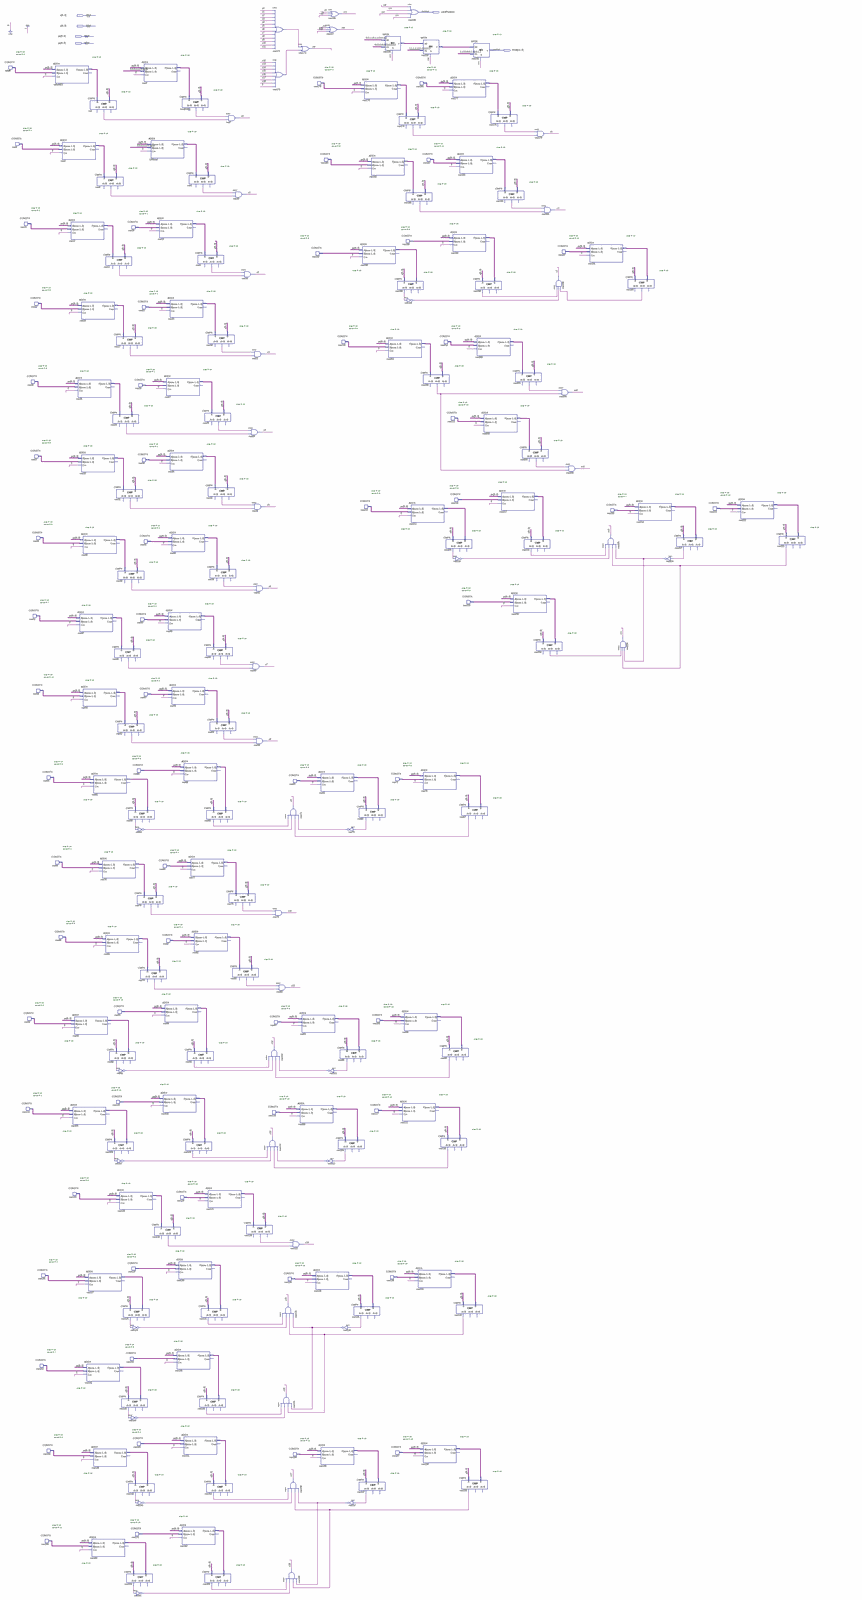
[diagram p0: schematic sheet, whole]
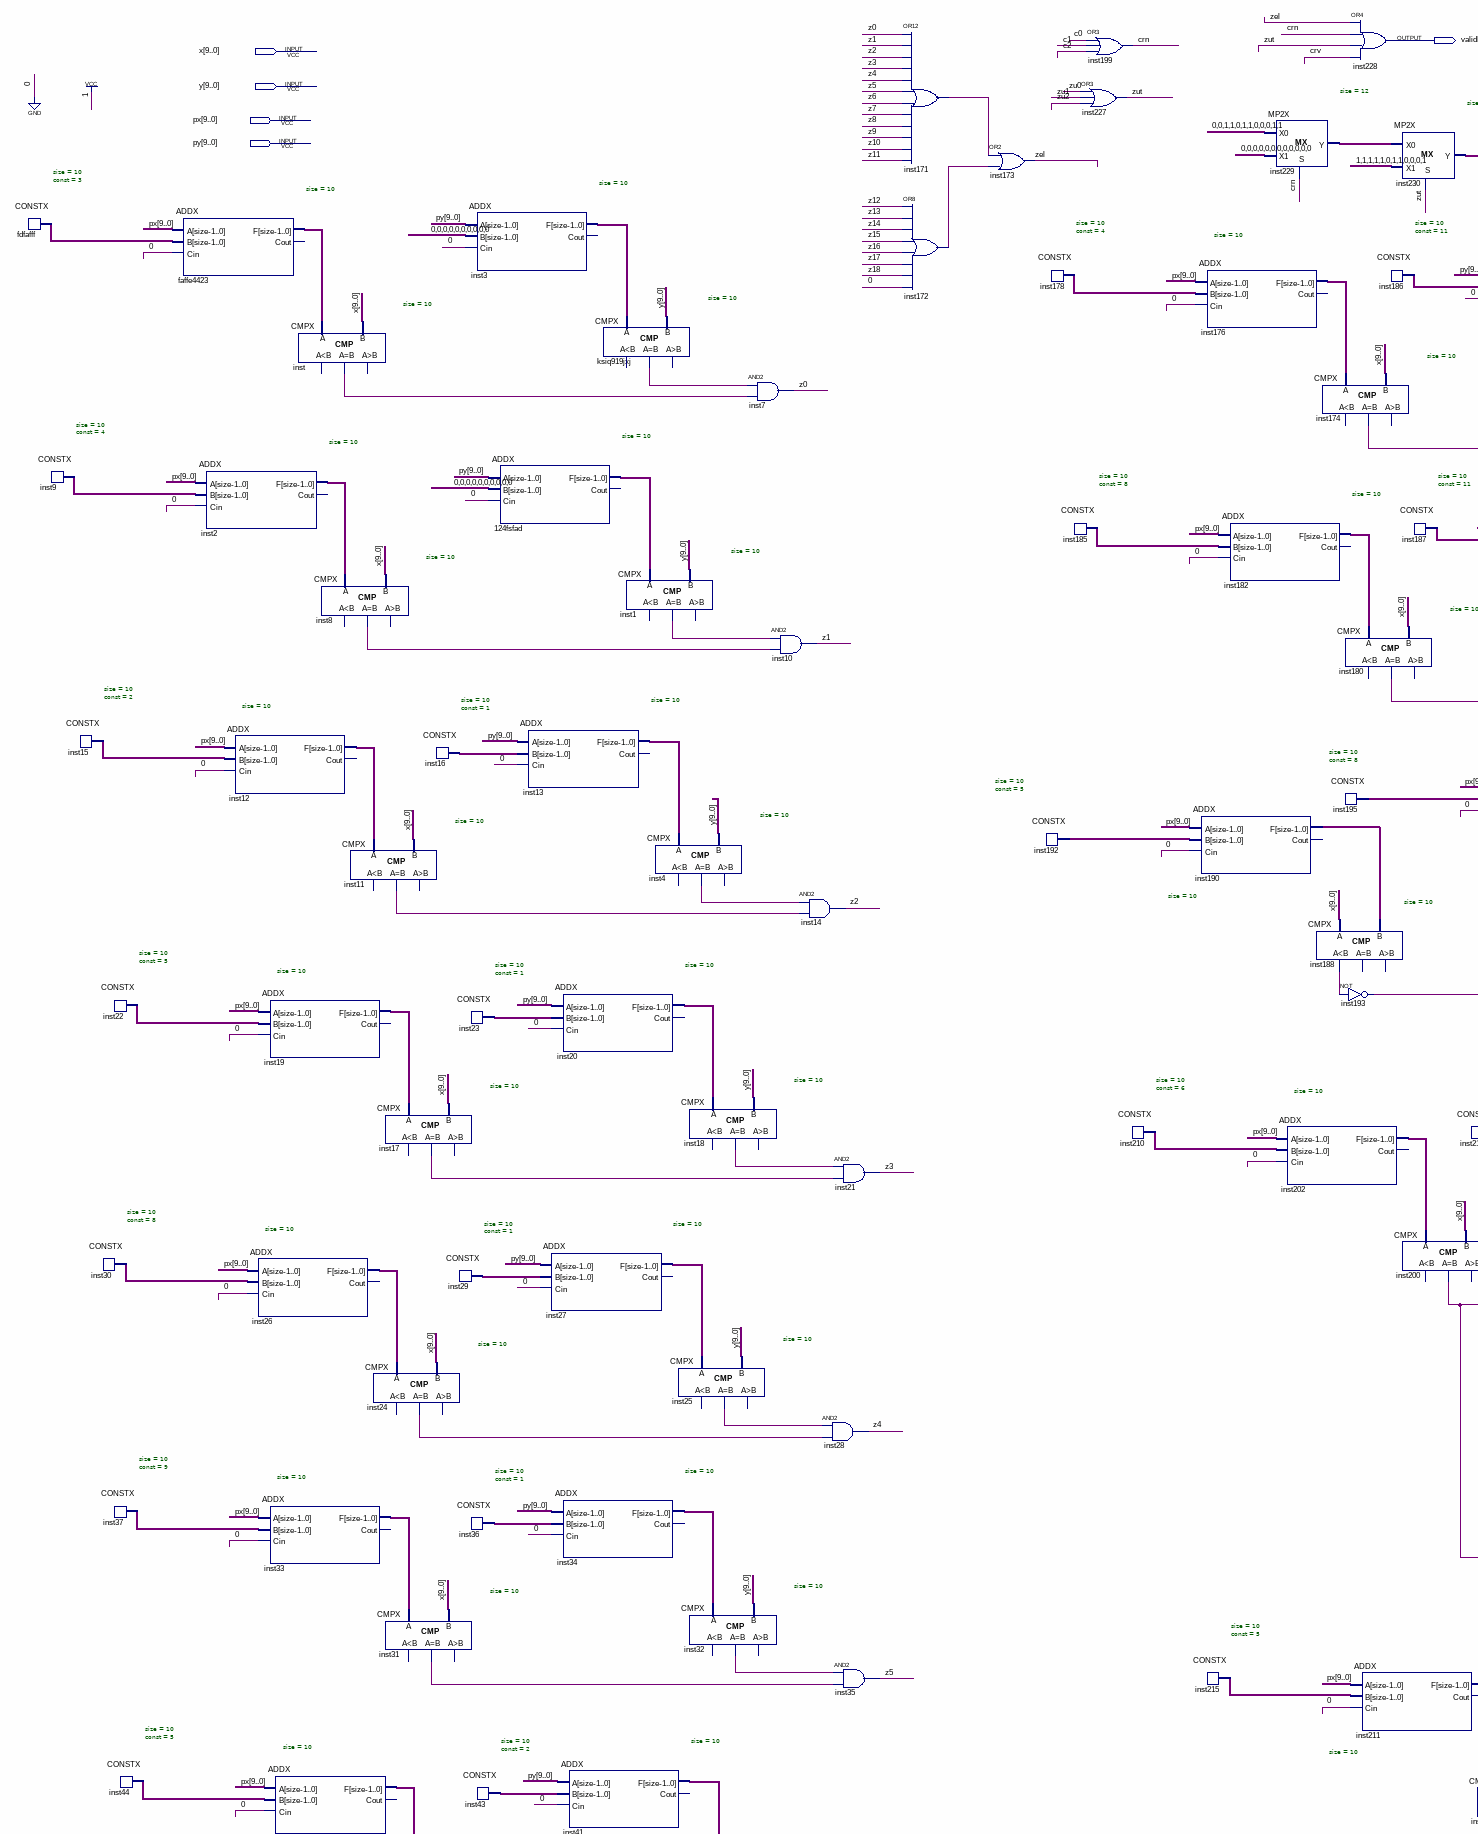
[diagram p1: schematic sheet, upper left part]
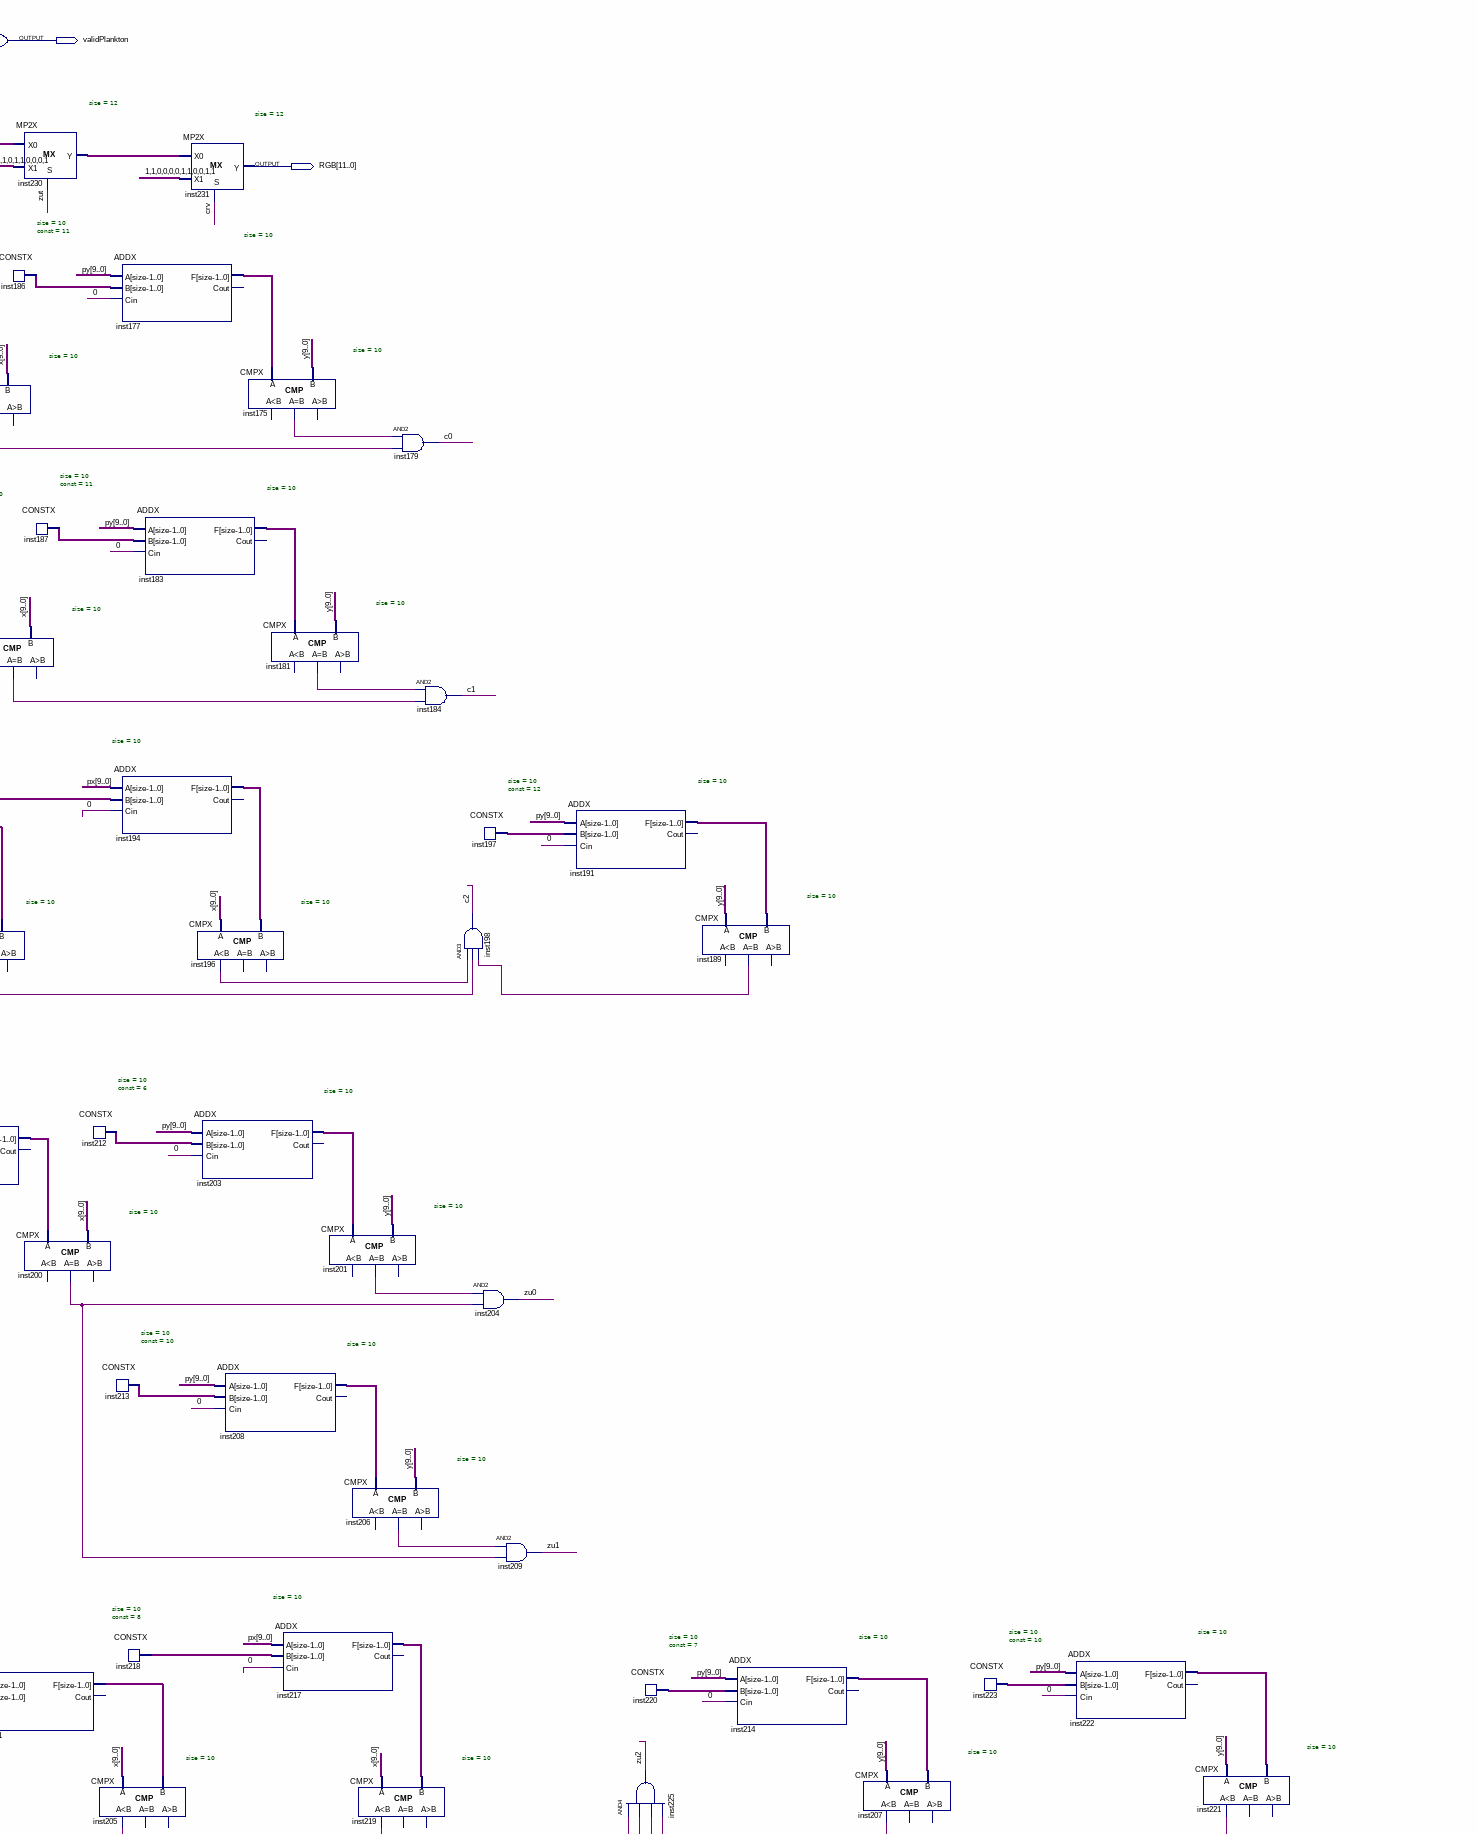
[diagram p2: schematic sheet, upper right part]
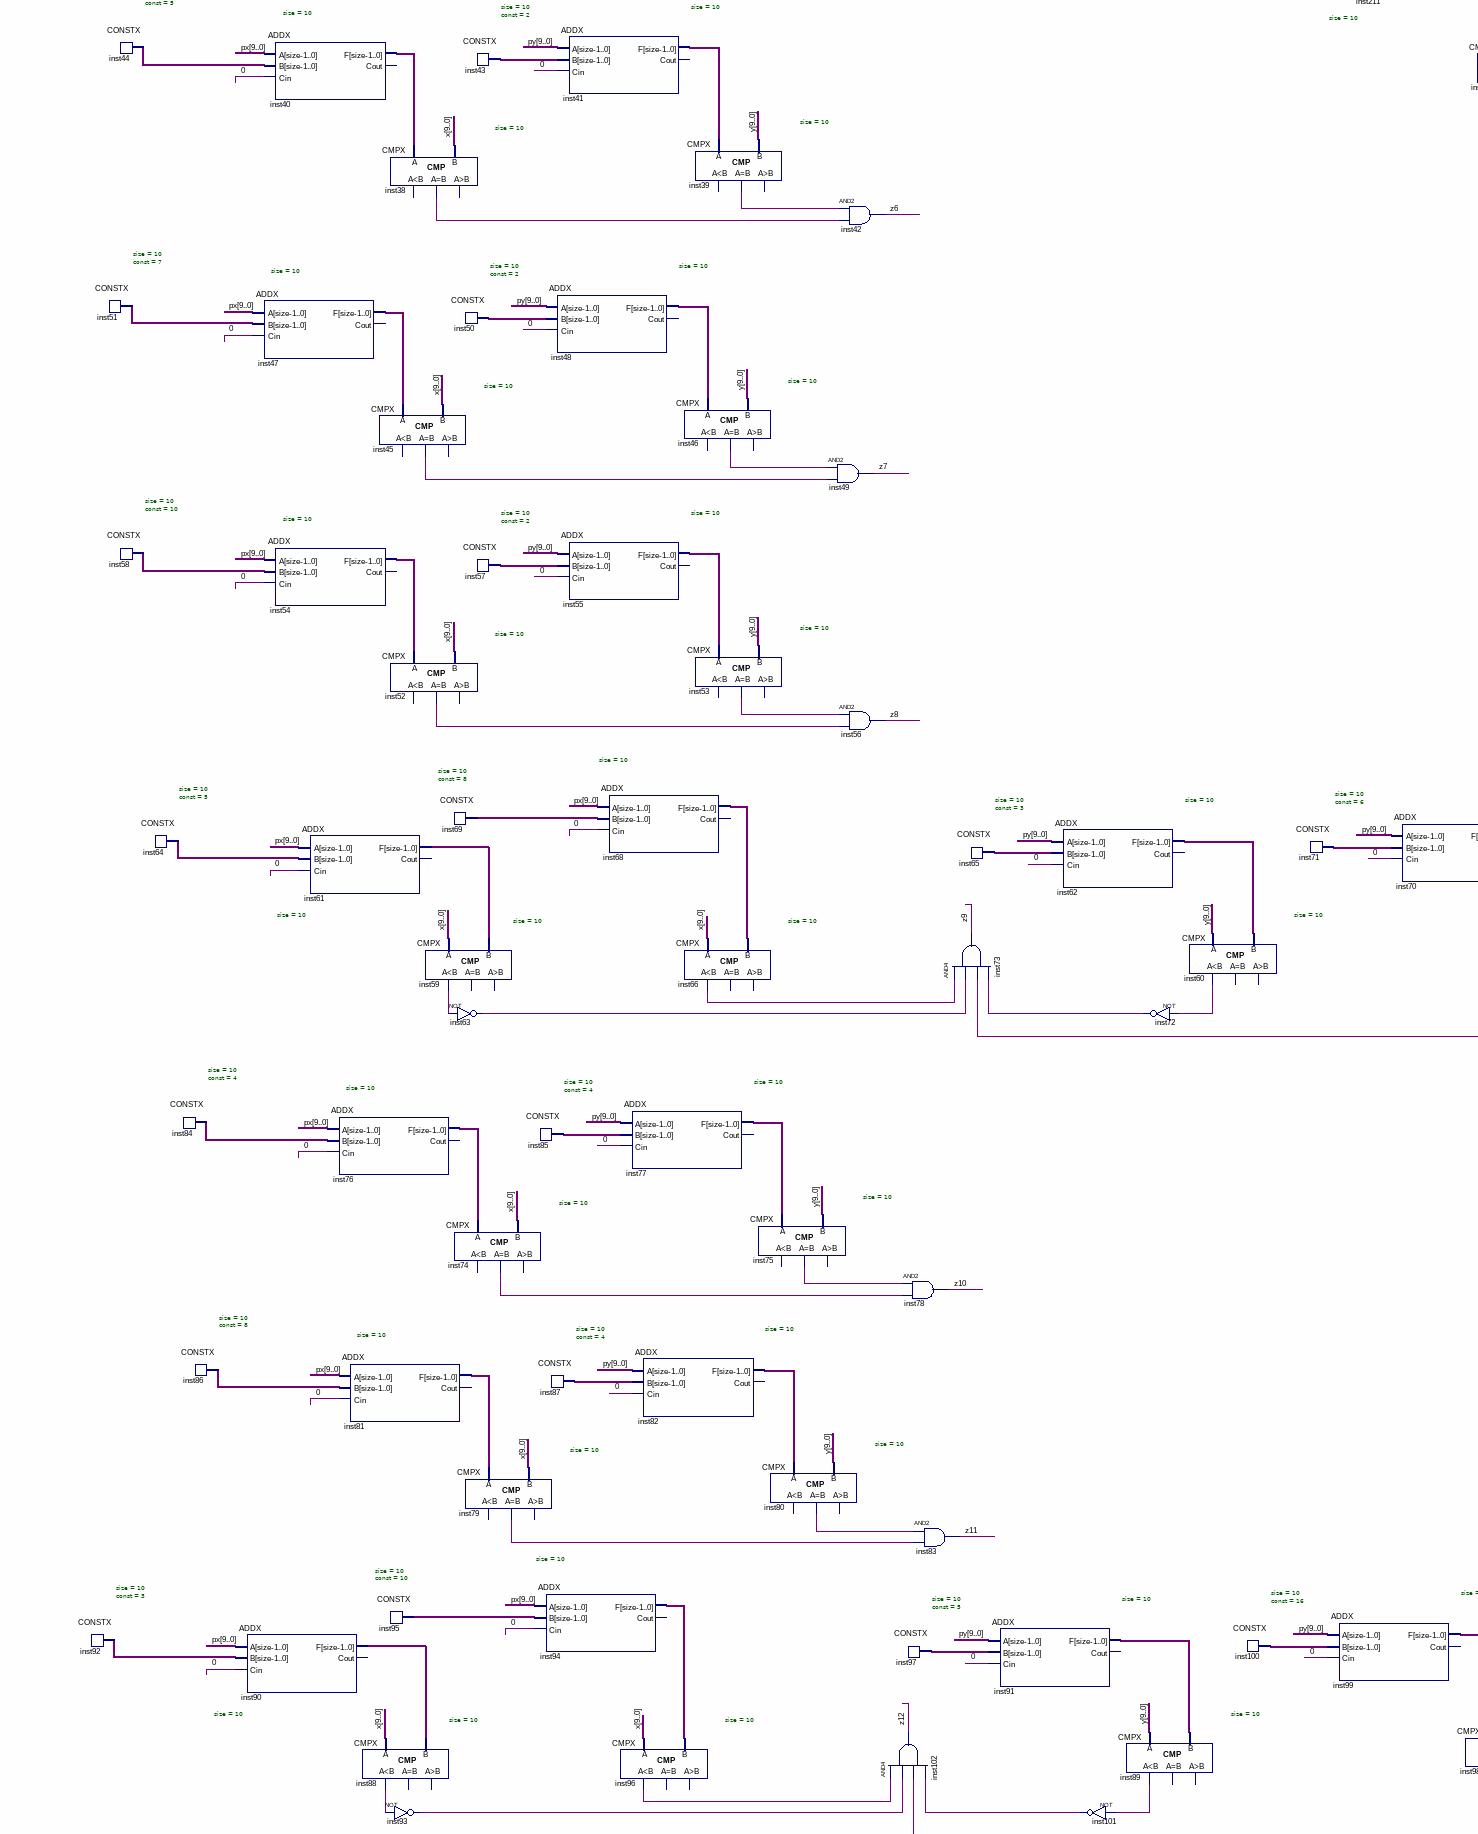
[diagram p3: schematic sheet, middle left part]
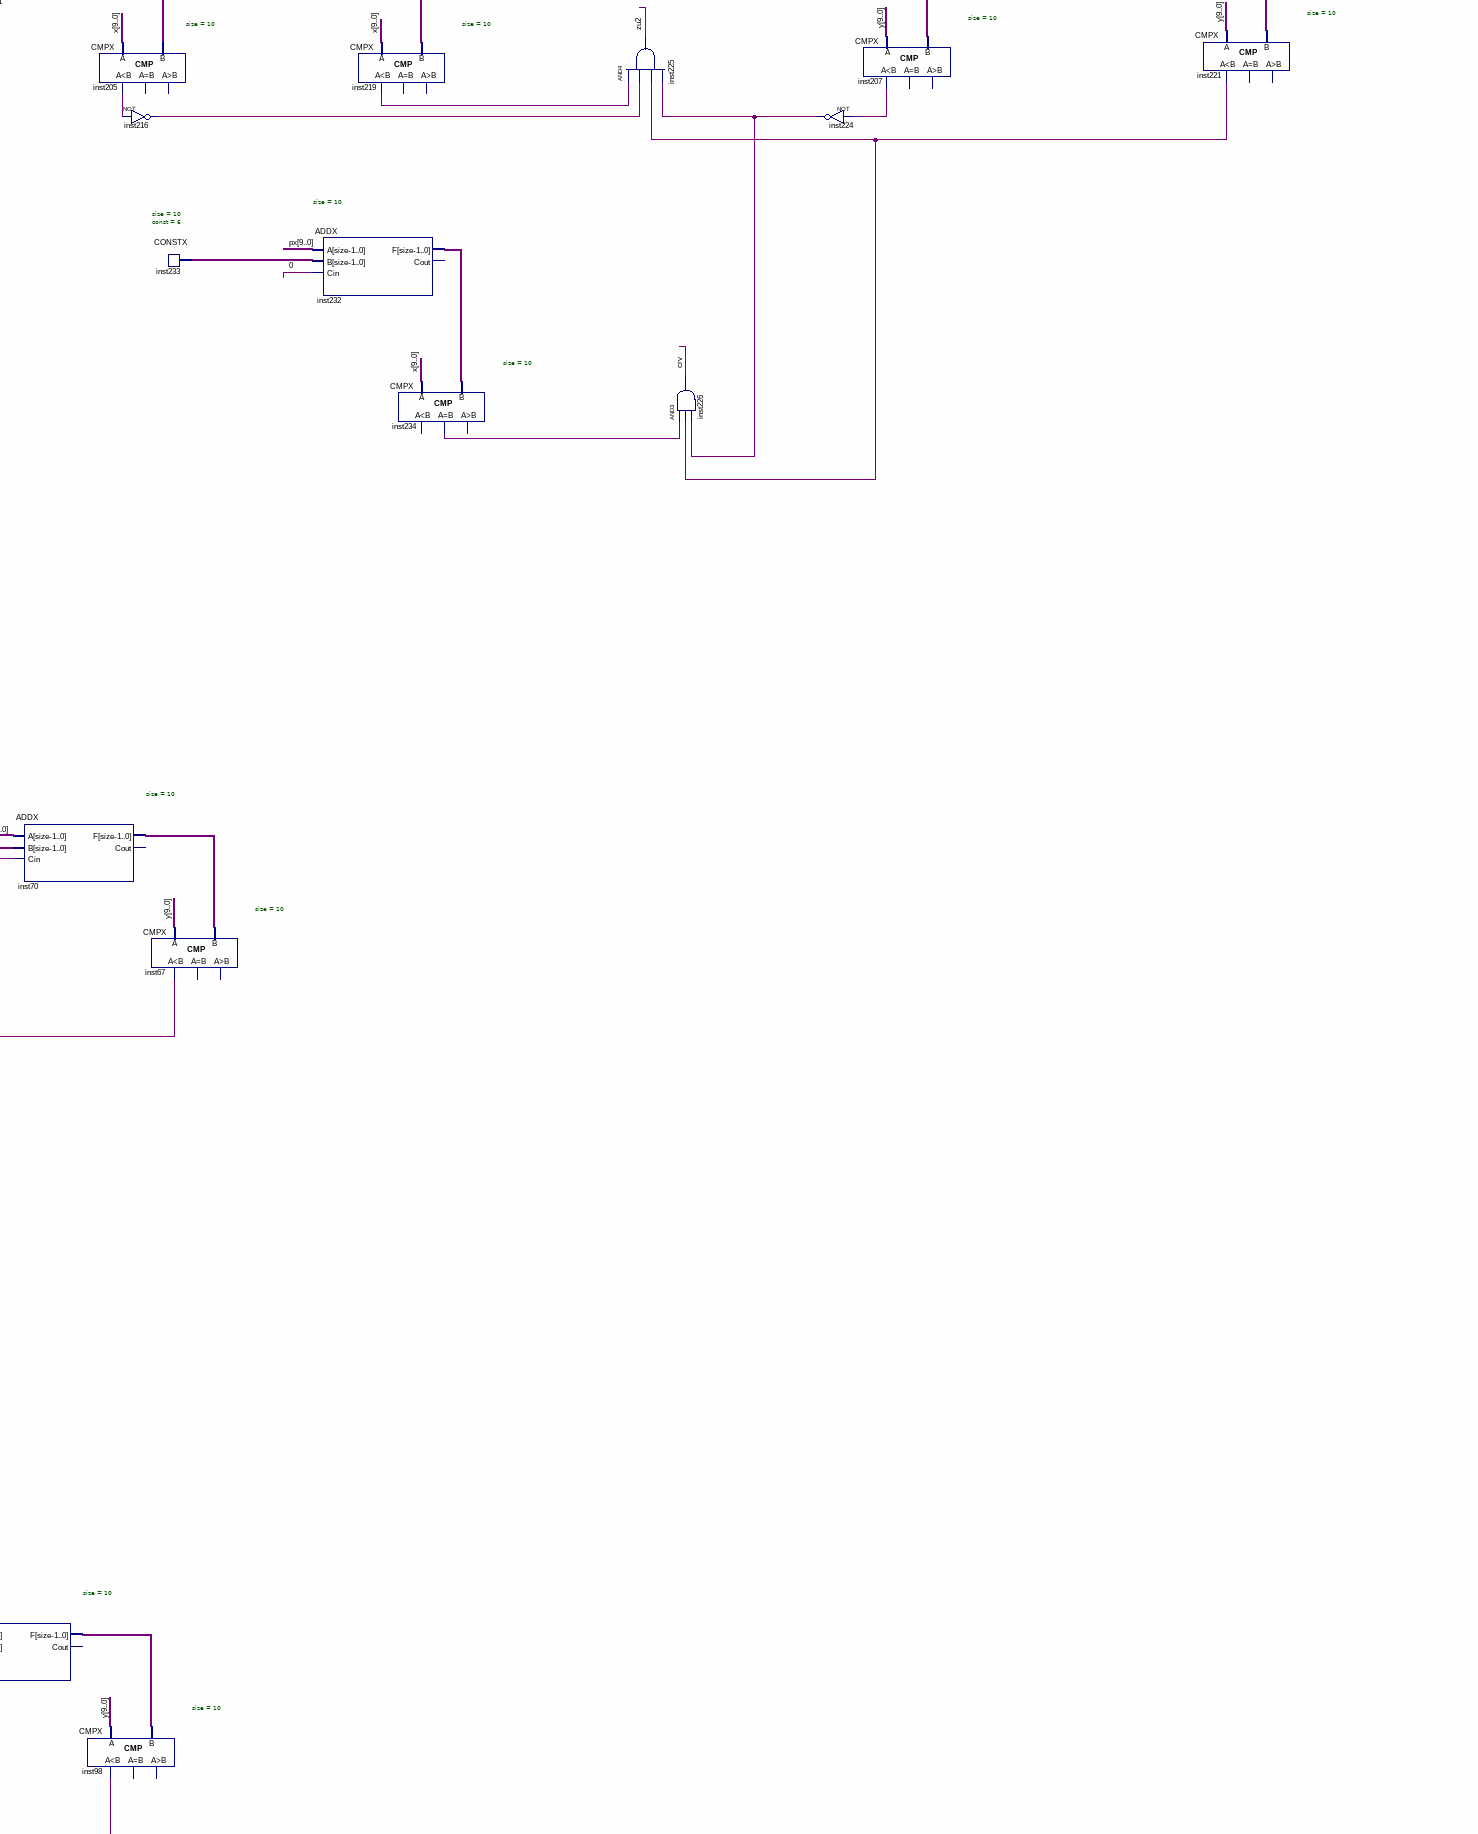
[diagram p4: schematic sheet, middle right part]
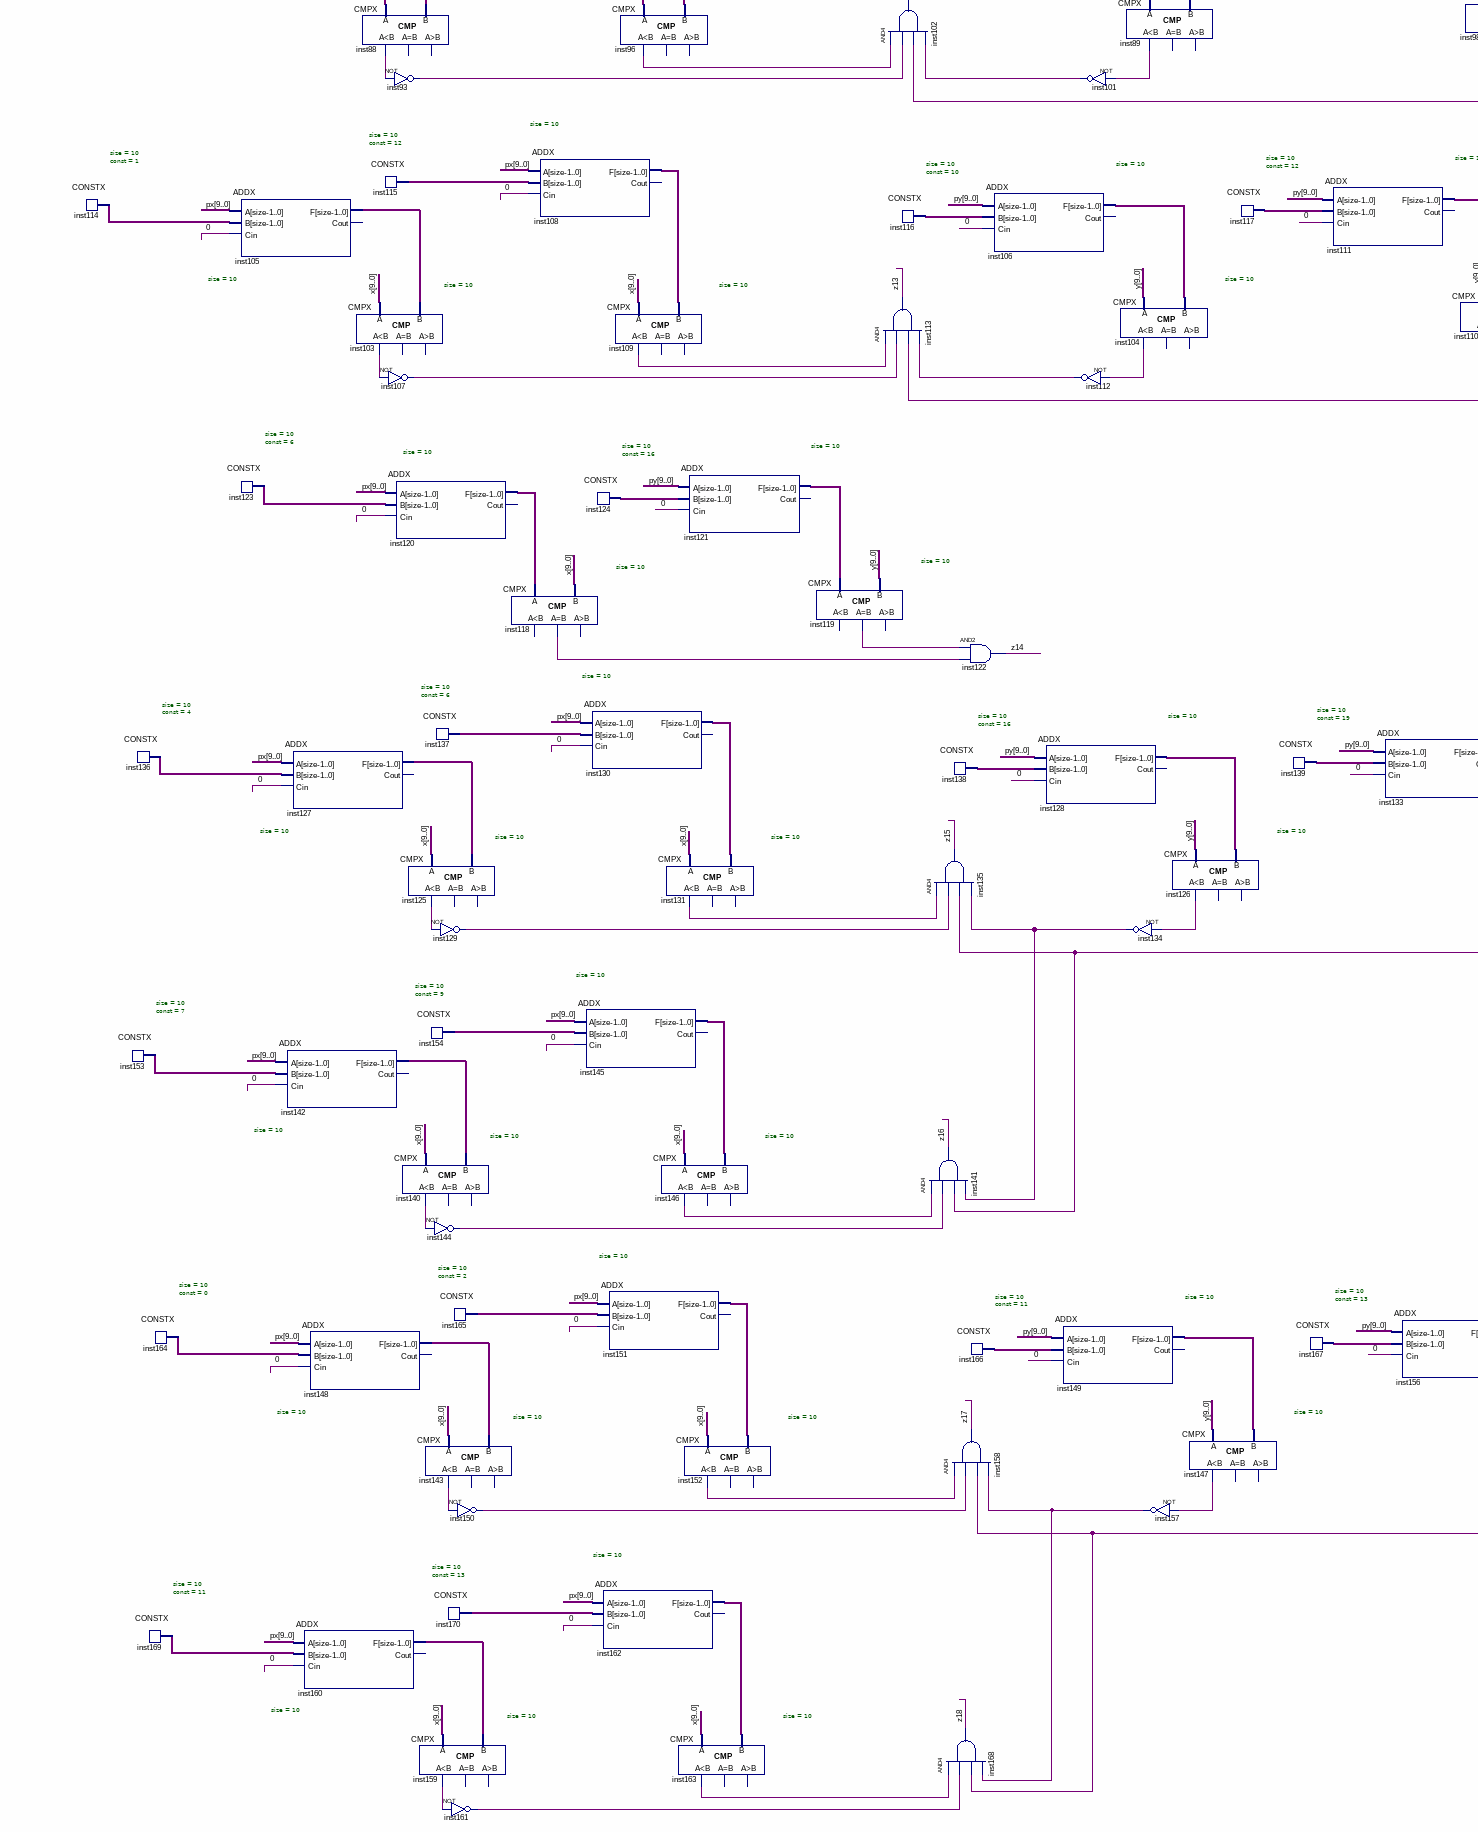
[diagram p5: schematic sheet, lower left part]
// Quartus schematic plankton.bdf as structural Verilog: 237 symbols, 6 pins
module plankton (
  input  [9:0] x,
  input  [9:0] y,
  input  [9:0] px,
  input  [9:0] py,
  output validPlankton,
  output [11:0] RGB
);

  wire c0, c1, c2, crn, crv, inst1_eq, inst4_eq, inst8_eq, inst11_eq, inst17_eq, inst18_eq, inst24_eq,
       inst25_eq, inst31_eq, inst32_eq, inst38_eq, inst39_eq, inst45_eq, inst46_eq, inst52_eq, inst53_eq,
       inst59_ls, inst60_ls, inst63_out, inst66_ls, inst67_ls, inst72_out, inst74_eq, inst75_eq, inst79_eq,
       inst80_eq, inst88_ls, inst89_ls, inst93_out, inst96_ls, inst98_ls, inst101_out, inst103_ls,
       inst104_ls, inst107_out, inst109_ls, inst110_ls, inst112_out, inst118_eq, inst119_eq, inst125_ls,
       inst126_ls, inst129_out, inst131_ls, inst132_ls, inst134_out, inst140_ls, inst143_ls, inst144_out,
       inst146_ls, inst147_ls, inst150_out, inst152_ls, inst155_ls, inst157_out, inst159_ls, inst161_out,
       inst163_ls, inst171_out, inst172_out, inst174_eq, inst175_eq, inst180_eq, inst181_eq, inst188_ls,
       inst189_eq, inst193_out, inst196_ls, inst200_eq, inst201_eq, inst205_ls, inst206_eq, inst207_ls,
       inst216_out, inst219_ls, inst221_ls, inst224_out, inst234_eq, inst_eq, ksiq919jxj_eq, z0, z1, z2, z3,
       z4, z5, z6, z7, z8, z9, z10, z11, z12, z13, z14, z15, z16, z17, z18, zel, zu0, zu1, zu2, zut;
  wire [9:0] faffe4423_f, fdfafff_data, inst2_f, inst3_f, inst9_data, inst12_f, inst13_f, inst15_data,
       inst16_data, inst19_f, inst20_f, inst22_data, inst23_data, inst26_f, inst27_f, inst29_data,
       inst30_data, inst33_f, inst34_f, inst36_data, inst37_data, inst40_f, inst41_f, inst43_data,
       inst44_data, inst47_f, inst48_f, inst50_data, inst51_data, inst54_f, inst55_f, inst57_data,
       inst58_data, inst61_f, inst62_f, inst64_data, inst65_data, inst68_f, inst69_data, inst70_f,
       inst71_data, inst76_f, inst77_f, inst81_f, inst82_f, inst84_data, inst85_data, inst86_data,
       inst87_data, inst90_f, inst91_f, inst92_data, inst94_f, inst95_data, inst97_data, inst99_f,
       inst100_data, inst105_f, inst106_f, inst108_f, inst111_f, inst114_data, inst115_data, inst116_data,
       inst117_data, inst120_f, inst121_f, inst123_data, inst124_data, inst127_f, inst128_f, inst130_f,
       inst133_f, inst136_data, inst137_data, inst138_data, inst139_data, inst142_f, inst145_f, inst148_f,
       inst149_f, inst151_f, inst153_data, inst154_data, inst156_f, inst160_f, inst162_f, inst164_data,
       inst165_data, inst166_data, inst167_data, inst169_data, inst170_data, inst176_f, inst177_f,
       inst178_data, inst182_f, inst183_f, inst185_data, inst186_data, inst187_data, inst190_f, inst191_f,
       inst192_data, inst194_f, inst195_data, inst197_data, inst202_f, inst203_f, inst208_f, inst210_data,
       inst211_f, inst212_data, inst213_data, inst214_f, inst215_data, inst217_f, inst218_data, inst220_data,
       inst222_f, inst223_data, inst232_f, inst233_data, n124fsfad_f;
  wire [11:0] inst229_y, inst230_y;

  CONSTX #(.size(10), .\const (3)) fdfafff (.data(fdfafff_data));
  CONSTX #(.size(10), .\const (4)) inst9 (.data(inst9_data));
  CONSTX #(.size(10), .\const (2)) inst15 (.data(inst15_data));
  CONSTX #(.size(10), .\const (5)) inst22 (.data(inst22_data));
  CONSTX #(.size(10), .\const (8)) inst30 (.data(inst30_data));
  CONSTX #(.size(10), .\const (9)) inst37 (.data(inst37_data));
  CONSTX #(.size(10), .\const (5)) inst44 (.data(inst44_data));
  CONSTX #(.size(10), .\const (7)) inst51 (.data(inst51_data));
  CONSTX #(.size(10), .\const (10)) inst58 (.data(inst58_data));
  CONSTX #(.size(10), .\const (3)) inst92 (.data(inst92_data));
  CONSTX #(.size(10), .\const (1)) inst114 (.data(inst114_data));
  CONSTX #(.size(10), .\const (5)) inst64 (.data(inst64_data));
  CONSTX #(.size(10), .\const (4)) inst136 (.data(inst136_data));
  CONSTX #(.size(10), .\const (7)) inst153 (.data(inst153_data));
  CONSTX #(.size(10), .\const (0)) inst164 (.data(inst164_data));
  CONSTX #(.size(10), .\const (11)) inst169 (.data(inst169_data));
  ADDX #(.size(10)) faffe4423 (.A(px), .B(fdfafff_data), .Cin(1'b0), .F(faffe4423_f));  // open: Cout
  ADDX #(.size(10)) inst2 (.A(px), .B(inst9_data), .Cin(1'b0), .F(inst2_f));  // open: Cout
  CONSTX #(.size(10), .\const (4)) inst84 (.data(inst84_data));
  CONSTX #(.size(10), .\const (8)) inst86 (.data(inst86_data));
  ADDX #(.size(10)) inst12 (.A(px), .B(inst15_data), .Cin(1'b0), .F(inst12_f));  // open: Cout
  ADDX #(.size(10)) inst26 (.A(px), .B(inst30_data), .Cin(1'b0), .F(inst26_f));  // open: Cout
  ADDX #(.size(10)) inst90 (.A(px), .B(inst92_data), .Cin(1'b0), .F(inst90_f));  // open: Cout
  ADDX #(.size(10)) inst105 (.A(px), .B(inst114_data), .Cin(1'b0), .F(inst105_f));  // open: Cout
  CONSTX #(.size(10), .\const (6)) inst123 (.data(inst123_data));
  CMPX #(.size(10)) inst (.A(faffe4423_f), .B(x), .eq(inst_eq));  // open: ls, gr
  ADDX #(.size(10)) inst19 (.A(px), .B(inst22_data), .Cin(1'b0), .F(inst19_f));  // open: Cout
  ADDX #(.size(10)) inst33 (.A(px), .B(inst37_data), .Cin(1'b0), .F(inst33_f));  // open: Cout
  ADDX #(.size(10)) inst40 (.A(px), .B(inst44_data), .Cin(1'b0), .F(inst40_f));  // open: Cout
  ADDX #(.size(10)) inst47 (.A(px), .B(inst51_data), .Cin(1'b0), .F(inst47_f));  // open: Cout
  ADDX #(.size(10)) inst54 (.A(px), .B(inst58_data), .Cin(1'b0), .F(inst54_f));  // open: Cout
  ADDX #(.size(10)) inst127 (.A(px), .B(inst136_data), .Cin(1'b0), .F(inst127_f));  // open: Cout
  ADDX #(.size(10)) inst142 (.A(px), .B(inst153_data), .Cin(1'b0), .F(inst142_f));  // open: Cout
  ADDX #(.size(10)) inst160 (.A(px), .B(inst169_data), .Cin(1'b0), .F(inst160_f));  // open: Cout
  CMPX #(.size(10)) inst8 (.A(inst2_f), .B(x), .eq(inst8_eq));  // open: ls, gr
  CMPX #(.size(10)) inst11 (.A(inst12_f), .B(x), .eq(inst11_eq));  // open: ls, gr
  ADDX #(.size(10)) inst61 (.A(px), .B(inst64_data), .Cin(1'b0), .F(inst61_f));  // open: Cout
  ADDX #(.size(10)) inst76 (.A(px), .B(inst84_data), .Cin(1'b0), .F(inst76_f));  // open: Cout
  ADDX #(.size(10)) inst81 (.A(px), .B(inst86_data), .Cin(1'b0), .F(inst81_f));  // open: Cout
  ADDX #(.size(10)) inst148 (.A(px), .B(inst164_data), .Cin(1'b0), .F(inst148_f));  // open: Cout
  CMPX #(.size(10)) inst17 (.A(inst19_f), .B(x), .eq(inst17_eq));  // open: ls, gr
  CMPX #(.size(10)) inst24 (.A(inst26_f), .B(x), .eq(inst24_eq));  // open: ls, gr
  CMPX #(.size(10)) inst31 (.A(inst33_f), .B(x), .eq(inst31_eq));  // open: ls, gr
  CMPX #(.size(10)) inst38 (.A(inst40_f), .B(x), .eq(inst38_eq));  // open: ls, gr
  CMPX #(.size(10)) inst45 (.A(inst47_f), .B(x), .eq(inst45_eq));  // open: ls, gr
  CMPX #(.size(10)) inst52 (.A(inst54_f), .B(x), .eq(inst52_eq));  // open: ls, gr
  CONSTX #(.size(10), .\const (10)) inst95 (.data(inst95_data));
  CMPX #(.size(10)) inst88 (.A(x), .B(inst90_f), .ls(inst88_ls));  // open: eq, gr
  not inst93 (inst93_out, inst88_ls);
  CONSTX #(.size(10), .\const (12)) inst115 (.data(inst115_data));
  CMPX #(.size(10)) inst103 (.A(x), .B(inst105_f), .ls(inst103_ls));  // open: eq, gr
  not inst107 (inst107_out, inst103_ls);
  ADDX #(.size(10)) inst120 (.A(px), .B(inst123_data), .Cin(1'b0), .F(inst120_f));  // open: Cout
  CONSTX #(.size(10), .\const (1)) inst16 (.data(inst16_data));
  CMPX #(.size(10)) inst59 (.A(x), .B(inst61_f), .ls(inst59_ls));  // open: eq, gr
  CONSTX #(.size(10), .\const (6)) inst137 (.data(inst137_data));
  CMPX #(.size(10)) inst125 (.A(x), .B(inst127_f), .ls(inst125_ls));  // open: eq, gr
  not inst129 (inst129_out, inst125_ls);
  CONSTX #(.size(10), .\const (9)) inst154 (.data(inst154_data));
  CMPX #(.size(10)) inst140 (.A(x), .B(inst142_f), .ls(inst140_ls));  // open: eq, gr
  not inst144 (inst144_out, inst140_ls);
  CMPX #(.size(10)) inst143 (.A(x), .B(inst148_f), .ls(inst143_ls));  // open: eq, gr
  CONSTX #(.size(10), .\const (13)) inst170 (.data(inst170_data));
  CMPX #(.size(10)) inst159 (.A(x), .B(inst160_f), .ls(inst159_ls));  // open: eq, gr
  ADDX #(.size(10)) inst3 (.A(py), .B({10{1'b0}}), .Cin(1'b0), .F(inst3_f));  // open: Cout
  CONSTX #(.size(10), .\const (1)) inst23 (.data(inst23_data));
  CONSTX #(.size(10), .\const (1)) inst29 (.data(inst29_data));
  CONSTX #(.size(10), .\const (1)) inst36 (.data(inst36_data));
  CONSTX #(.size(10), .\const (2)) inst43 (.data(inst43_data));
  CONSTX #(.size(10), .\const (2)) inst50 (.data(inst50_data));
  CONSTX #(.size(10), .\const (2)) inst57 (.data(inst57_data));
  CONSTX #(.size(10), .\const (8)) inst69 (.data(inst69_data));
  not inst63 (inst63_out, inst59_ls);
  CMPX #(.size(10)) inst74 (.A(inst76_f), .B(x), .eq(inst74_eq));  // open: ls, gr
  CMPX #(.size(10)) inst79 (.A(inst81_f), .B(x), .eq(inst79_eq));  // open: ls, gr
  CONSTX #(.size(10), .\const (2)) inst165 (.data(inst165_data));
  not inst150 (inst150_out, inst143_ls);
  not inst161 (inst161_out, inst159_ls);
  ADDX #(.size(10)) u_124fsfad (.A(py), .B({10{1'b0}}), .Cin(1'b0), .F(n124fsfad_f));  // open: Cout
  ADDX #(.size(10)) inst13 (.A(py), .B(inst16_data), .Cin(1'b0), .F(inst13_f));  // open: Cout
  CONSTX #(.size(10), .\const (4)) inst85 (.data(inst85_data));
  CMPX #(.size(10)) inst118 (.A(inst120_f), .B(x), .eq(inst118_eq));  // open: ls, gr
  ADDX #(.size(10)) inst20 (.A(py), .B(inst23_data), .Cin(1'b0), .F(inst20_f));  // open: Cout
  ADDX #(.size(10)) inst27 (.A(py), .B(inst29_data), .Cin(1'b0), .F(inst27_f));  // open: Cout
  ADDX #(.size(10)) inst34 (.A(py), .B(inst36_data), .Cin(1'b0), .F(inst34_f));  // open: Cout
  ADDX #(.size(10)) inst41 (.A(py), .B(inst43_data), .Cin(1'b0), .F(inst41_f));  // open: Cout
  ADDX #(.size(10)) inst48 (.A(py), .B(inst50_data), .Cin(1'b0), .F(inst48_f));  // open: Cout
  ADDX #(.size(10)) inst55 (.A(py), .B(inst57_data), .Cin(1'b0), .F(inst55_f));  // open: Cout
  CONSTX #(.size(10), .\const (4)) inst87 (.data(inst87_data));
  ADDX #(.size(10)) inst94 (.A(px), .B(inst95_data), .Cin(1'b0), .F(inst94_f));  // open: Cout
  ADDX #(.size(10)) inst108 (.A(px), .B(inst115_data), .Cin(1'b0), .F(inst108_f));  // open: Cout
  CMPX #(.size(10)) ksiq919jxj (.A(inst3_f), .B(y), .eq(ksiq919jxj_eq));  // open: ls, gr
  CMPX #(.size(10)) inst1 (.A(n124fsfad_f), .B(y), .eq(inst1_eq));  // open: ls, gr
  ADDX #(.size(10)) inst68 (.A(px), .B(inst69_data), .Cin(1'b0), .F(inst68_f));  // open: Cout
  CMPX #(.size(10)) inst96 (.A(x), .B(inst94_f), .ls(inst96_ls));  // open: eq, gr
  CMPX #(.size(10)) inst109 (.A(x), .B(inst108_f), .ls(inst109_ls));  // open: eq, gr
  CONSTX #(.size(10), .\const (16)) inst124 (.data(inst124_data));
  ADDX #(.size(10)) inst130 (.A(px), .B(inst137_data), .Cin(1'b0), .F(inst130_f));  // open: Cout
  ADDX #(.size(10)) inst145 (.A(px), .B(inst154_data), .Cin(1'b0), .F(inst145_f));  // open: Cout
  ADDX #(.size(10)) inst151 (.A(px), .B(inst165_data), .Cin(1'b0), .F(inst151_f));  // open: Cout
  ADDX #(.size(10)) inst162 (.A(px), .B(inst170_data), .Cin(1'b0), .F(inst162_f));  // open: Cout
  CMPX #(.size(10)) inst4 (.A(inst13_f), .B(y), .eq(inst4_eq));  // open: ls, gr
  ADDX #(.size(10)) inst77 (.A(py), .B(inst85_data), .Cin(1'b0), .F(inst77_f));  // open: Cout
  ADDX #(.size(10)) inst82 (.A(py), .B(inst87_data), .Cin(1'b0), .F(inst82_f));  // open: Cout
  CMPX #(.size(10)) inst131 (.A(x), .B(inst130_f), .ls(inst131_ls));  // open: eq, gr
  CMPX #(.size(10)) inst146 (.A(x), .B(inst145_f), .ls(inst146_ls));  // open: eq, gr
  CMPX #(.size(10)) inst18 (.A(inst20_f), .B(y), .eq(inst18_eq));  // open: ls, gr
  CMPX #(.size(10)) inst25 (.A(inst27_f), .B(y), .eq(inst25_eq));  // open: ls, gr
  CMPX #(.size(10)) inst32 (.A(inst34_f), .B(y), .eq(inst32_eq));  // open: ls, gr
  CMPX #(.size(10)) inst39 (.A(inst41_f), .B(y), .eq(inst39_eq));  // open: ls, gr
  CMPX #(.size(10)) inst46 (.A(inst48_f), .B(y), .eq(inst46_eq));  // open: ls, gr
  CMPX #(.size(10)) inst53 (.A(inst55_f), .B(y), .eq(inst53_eq));  // open: ls, gr
  CMPX #(.size(10)) inst66 (.A(x), .B(inst68_f), .ls(inst66_ls));  // open: eq, gr
  ADDX #(.size(10)) inst121 (.A(py), .B(inst124_data), .Cin(1'b0), .F(inst121_f));  // open: Cout
  CMPX #(.size(10)) inst152 (.A(x), .B(inst151_f), .ls(inst152_ls));  // open: eq, gr
  CMPX #(.size(10)) inst163 (.A(x), .B(inst162_f), .ls(inst163_ls));  // open: eq, gr
  and inst7 (z0, ksiq919jxj_eq, inst_eq);
  CMPX #(.size(10)) inst75 (.A(inst77_f), .B(y), .eq(inst75_eq));  // open: ls, gr
  and inst10 (z1, inst1_eq, inst8_eq);
  and inst14 (z2, inst4_eq, inst11_eq);
  CMPX #(.size(10)) inst80 (.A(inst82_f), .B(y), .eq(inst80_eq));  // open: ls, gr
  and inst21 (z3, inst18_eq, inst17_eq);
  and inst28 (z4, inst25_eq, inst24_eq);
  and inst35 (z5, inst32_eq, inst31_eq);
  and inst42 (z6, inst39_eq, inst38_eq);
  and inst49 (z7, inst46_eq, inst45_eq);
  and inst56 (z8, inst53_eq, inst52_eq);
  CMPX #(.size(10)) inst119 (.A(inst121_f), .B(y), .eq(inst119_eq));  // open: ls, gr
  CONSTX #(.size(10), .\const (5)) inst97 (.data(inst97_data));
  and inst102 (z12, inst96_ls, inst93_out, inst98_ls, inst101_out);
  CONSTX #(.size(10), .\const (10)) inst116 (.data(inst116_data));
  and inst113 (z13, inst109_ls, inst107_out, inst110_ls, inst112_out);
  or inst171 (inst171_out, z0, z1, z2, z3, z4, z5, z6, z7, z8, z9, z10, z11);
  or inst172 (inst172_out, z12, z13, z14, z15, z16, z17, z18, 1'b0);
  and inst78 (z10, inst75_eq, inst74_eq);
  and inst83 (z11, inst80_eq, inst79_eq);
  CONSTX #(.size(10), .\const (16)) inst138 (.data(inst138_data));
  and inst135 (z15, inst131_ls, inst129_out, inst132_ls, inst134_out);
  and inst141 (z16, inst146_ls, inst144_out, inst132_ls, inst134_out);
  and inst168 (z18, inst163_ls, inst161_out, inst155_ls, inst157_out);
  CONSTX #(.size(10), .\const (3)) inst65 (.data(inst65_data));
  and inst73 (z9, inst66_ls, inst63_out, inst67_ls, inst72_out);
  ADDX #(.size(10)) inst106 (.A(py), .B(inst116_data), .Cin(1'b0), .F(inst106_f));  // open: Cout
  and inst122 (z14, inst119_eq, inst118_eq);
  CONSTX #(.size(10), .\const (11)) inst166 (.data(inst166_data));
  and inst158 (z17, inst152_ls, inst150_out, inst155_ls, inst157_out);
  or inst173 (zel, inst171_out, inst172_out);
  CONSTX #(.size(10), .\const (5)) inst192 (.data(inst192_data));
  ADDX #(.size(10)) inst91 (.A(py), .B(inst97_data), .Cin(1'b0), .F(inst91_f));  // open: Cout
  CONSTX #(.size(10), .\const (4)) inst178 (.data(inst178_data));
  CONSTX #(.size(10), .\const (8)) inst185 (.data(inst185_data));
  ADDX #(.size(10)) inst62 (.A(py), .B(inst65_data), .Cin(1'b0), .F(inst62_f));  // open: Cout
  not inst112 (inst112_out, inst104_ls);
  ADDX #(.size(10)) inst128 (.A(py), .B(inst138_data), .Cin(1'b0), .F(inst128_f));  // open: Cout
  ADDX #(.size(10)) inst149 (.A(py), .B(inst166_data), .Cin(1'b0), .F(inst149_f));  // open: Cout
  or inst199 (crn, c0, c1, c2);
  or inst227 (zut, zu0, zu1, zu2);
  CONSTX #(.size(10), .\const (6)) inst210 (.data(inst210_data));
  CMPX #(.size(10)) inst89 (.A(y), .B(inst91_f), .ls(inst89_ls));  // open: eq, gr
  not inst101 (inst101_out, inst89_ls);
  CMPX #(.size(10)) inst104 (.A(y), .B(inst106_f), .ls(inst104_ls));  // open: eq, gr
  not inst72 (inst72_out, inst60_ls);
  CMPX #(.size(10)) inst126 (.A(y), .B(inst128_f), .ls(inst126_ls));  // open: eq, gr
  not inst134 (inst134_out, inst126_ls);
  not inst157 (inst157_out, inst147_ls);
  ADDX #(.size(10)) inst176 (.A(px), .B(inst178_data), .Cin(1'b0), .F(inst176_f));  // open: Cout
  ADDX #(.size(10)) inst190 (.A(px), .B(inst192_data), .Cin(1'b0), .F(inst190_f));  // open: Cout
  CONSTX #(.size(10), .\const (5)) inst215 (.data(inst215_data));
  CMPX #(.size(10)) inst60 (.A(y), .B(inst62_f), .ls(inst60_ls));  // open: eq, gr
  CMPX #(.size(10)) inst147 (.A(y), .B(inst149_f), .ls(inst147_ls));  // open: eq, gr
  ADDX #(.size(10)) inst182 (.A(px), .B(inst185_data), .Cin(1'b0), .F(inst182_f));  // open: Cout
  CONSTX #(.size(10), .\const (16)) inst100 (.data(inst100_data));
  CONSTX #(.size(10), .\const (12)) inst117 (.data(inst117_data));
  MP2X #(.size(12)) inst229 (.S(crn), .X0(12'b001101100011), .X1({12{1'b0}}), .Y(inst229_y));
  CMPX #(.size(10)) inst188 (.A(x), .B(inst190_f), .ls(inst188_ls));  // open: eq, gr
  ADDX #(.size(10)) inst202 (.A(px), .B(inst210_data), .Cin(1'b0), .F(inst202_f));  // open: Cout
  CONSTX #(.size(10), .\const (6)) inst71 (.data(inst71_data));
  CONSTX #(.size(10), .\const (19)) inst139 (.data(inst139_data));
  CONSTX #(.size(10), .\const (13)) inst167 (.data(inst167_data));
  or inst228 (validPlankton, zel, crn, zut, crv);
  CMPX #(.size(10)) inst174 (.A(inst176_f), .B(x), .eq(inst174_eq));  // open: ls, gr
  CMPX #(.size(10)) inst180 (.A(inst182_f), .B(x), .eq(inst180_eq));  // open: ls, gr
  CONSTX #(.size(10), .\const (8)) inst195 (.data(inst195_data));
  not inst193 (inst193_out, inst188_ls);
  ADDX #(.size(10)) inst211 (.A(px), .B(inst215_data), .Cin(1'b0), .F(inst211_f));  // open: Cout
  ADDX #(.size(10)) inst99 (.A(py), .B(inst100_data), .Cin(1'b0), .F(inst99_f));  // open: Cout
  ADDX #(.size(10)) inst111 (.A(py), .B(inst117_data), .Cin(1'b0), .F(inst111_f));  // open: Cout
  MP2X #(.size(12)) inst230 (.S(zut), .X0(inst229_y), .X1(12'b111110110001), .Y(inst230_y));
  CONSTX #(.size(10), .\const (11)) inst186 (.data(inst186_data));
  CONSTX #(.size(10), .\const (11)) inst187 (.data(inst187_data));
  CMPX #(.size(10)) inst200 (.A(inst202_f), .B(x), .eq(inst200_eq));  // open: ls, gr
  ADDX #(.size(10)) inst70 (.A(py), .B(inst71_data), .Cin(1'b0), .F(inst70_f));  // open: Cout
  ADDX #(.size(10)) inst133 (.A(py), .B(inst139_data), .Cin(1'b0), .F(inst133_f));  // open: Cout
  ADDX #(.size(10)) inst156 (.A(py), .B(inst167_data), .Cin(1'b0), .F(inst156_f));  // open: Cout
  ADDX #(.size(10)) inst177 (.A(py), .B(inst186_data), .Cin(1'b0), .F(inst177_f));  // open: Cout
  ADDX #(.size(10)) inst194 (.A(px), .B(inst195_data), .Cin(1'b0), .F(inst194_f));  // open: Cout
  CONSTX #(.size(10), .\const (6)) inst212 (.data(inst212_data));
  CONSTX #(.size(10), .\const (10)) inst213 (.data(inst213_data));
  CONSTX #(.size(10), .\const (8)) inst218 (.data(inst218_data));
  CMPX #(.size(10)) inst205 (.A(x), .B(inst211_f), .ls(inst205_ls));  // open: eq, gr
  CMPX #(.size(10)) inst98 (.A(y), .B(inst99_f), .ls(inst98_ls));  // open: eq, gr
  CMPX #(.size(10)) inst110 (.A(y), .B(inst111_f), .ls(inst110_ls));  // open: eq, gr
  ADDX #(.size(10)) inst183 (.A(py), .B(inst187_data), .Cin(1'b0), .F(inst183_f));  // open: Cout
  not inst216 (inst216_out, inst205_ls);
  CONSTX #(.size(10), .\const (6)) inst233 (.data(inst233_data));
  CMPX #(.size(10)) inst67 (.A(y), .B(inst70_f), .ls(inst67_ls));  // open: eq, gr
  CMPX #(.size(10)) inst132 (.A(y), .B(inst133_f), .ls(inst132_ls));  // open: eq, gr
  CMPX #(.size(10)) inst155 (.A(y), .B(inst156_f), .ls(inst155_ls));  // open: eq, gr
  MP2X #(.size(12)) inst231 (.S(crv), .X0(inst230_y), .X1(12'b110000110011), .Y(RGB));
  CMPX #(.size(10)) inst196 (.A(x), .B(inst194_f), .ls(inst196_ls));  // open: eq, gr
  ADDX #(.size(10)) inst203 (.A(py), .B(inst212_data), .Cin(1'b0), .F(inst203_f));  // open: Cout
  CMPX #(.size(10)) inst175 (.A(inst177_f), .B(y), .eq(inst175_eq));  // open: ls, gr
  ADDX #(.size(10)) inst208 (.A(py), .B(inst213_data), .Cin(1'b0), .F(inst208_f));  // open: Cout
  CMPX #(.size(10)) inst181 (.A(inst183_f), .B(y), .eq(inst181_eq));  // open: ls, gr
  ADDX #(.size(10)) inst217 (.A(px), .B(inst218_data), .Cin(1'b0), .F(inst217_f));  // open: Cout
  CMPX #(.size(10)) inst201 (.A(inst203_f), .B(y), .eq(inst201_eq));  // open: ls, gr
  CMPX #(.size(10)) inst206 (.A(inst208_f), .B(y), .eq(inst206_eq));  // open: ls, gr
  ADDX #(.size(10)) inst232 (.A(px), .B(inst233_data), .Cin(1'b0), .F(inst232_f));  // open: Cout
  CMPX #(.size(10)) inst219 (.A(x), .B(inst217_f), .ls(inst219_ls));  // open: eq, gr
  CMPX #(.size(10)) inst234 (.A(x), .B(inst232_f), .eq(inst234_eq));  // open: ls, gr
  and inst179 (c0, inst175_eq, inst174_eq);
  and inst184 (c1, inst181_eq, inst180_eq);
  CONSTX #(.size(10), .\const (12)) inst197 (.data(inst197_data));
  and inst198 (c2, inst196_ls, inst193_out, inst189_eq);
  and inst204 (zu0, inst201_eq, inst200_eq);
  and inst209 (zu1, inst206_eq, inst200_eq);
  ADDX #(.size(10)) inst191 (.A(py), .B(inst197_data), .Cin(1'b0), .F(inst191_f));  // open: Cout
  and inst225 (zu2, inst219_ls, inst216_out, inst221_ls, inst224_out);
  CONSTX #(.size(10), .\const (7)) inst220 (.data(inst220_data));
  CMPX #(.size(10)) inst189 (.A(y), .B(inst191_f), .eq(inst189_eq));  // open: ls, gr
  and inst226 (crv, inst234_eq, inst221_ls, inst224_out);
  ADDX #(.size(10)) inst214 (.A(py), .B(inst220_data), .Cin(1'b0), .F(inst214_f));  // open: Cout
  not inst224 (inst224_out, inst207_ls);
  CMPX #(.size(10)) inst207 (.A(y), .B(inst214_f), .ls(inst207_ls));  // open: eq, gr
  CONSTX #(.size(10), .\const (10)) inst223 (.data(inst223_data));
  ADDX #(.size(10)) inst222 (.A(py), .B(inst223_data), .Cin(1'b0), .F(inst222_f));  // open: Cout
  CMPX #(.size(10)) inst221 (.A(y), .B(inst222_f), .ls(inst221_ls));  // open: eq, gr
endmodule
